# Altium schematic sheet Fluid_Valve_CTRL.SchDoc
size OrCAD B; SheetNumber: 6; SheetTotal: 11
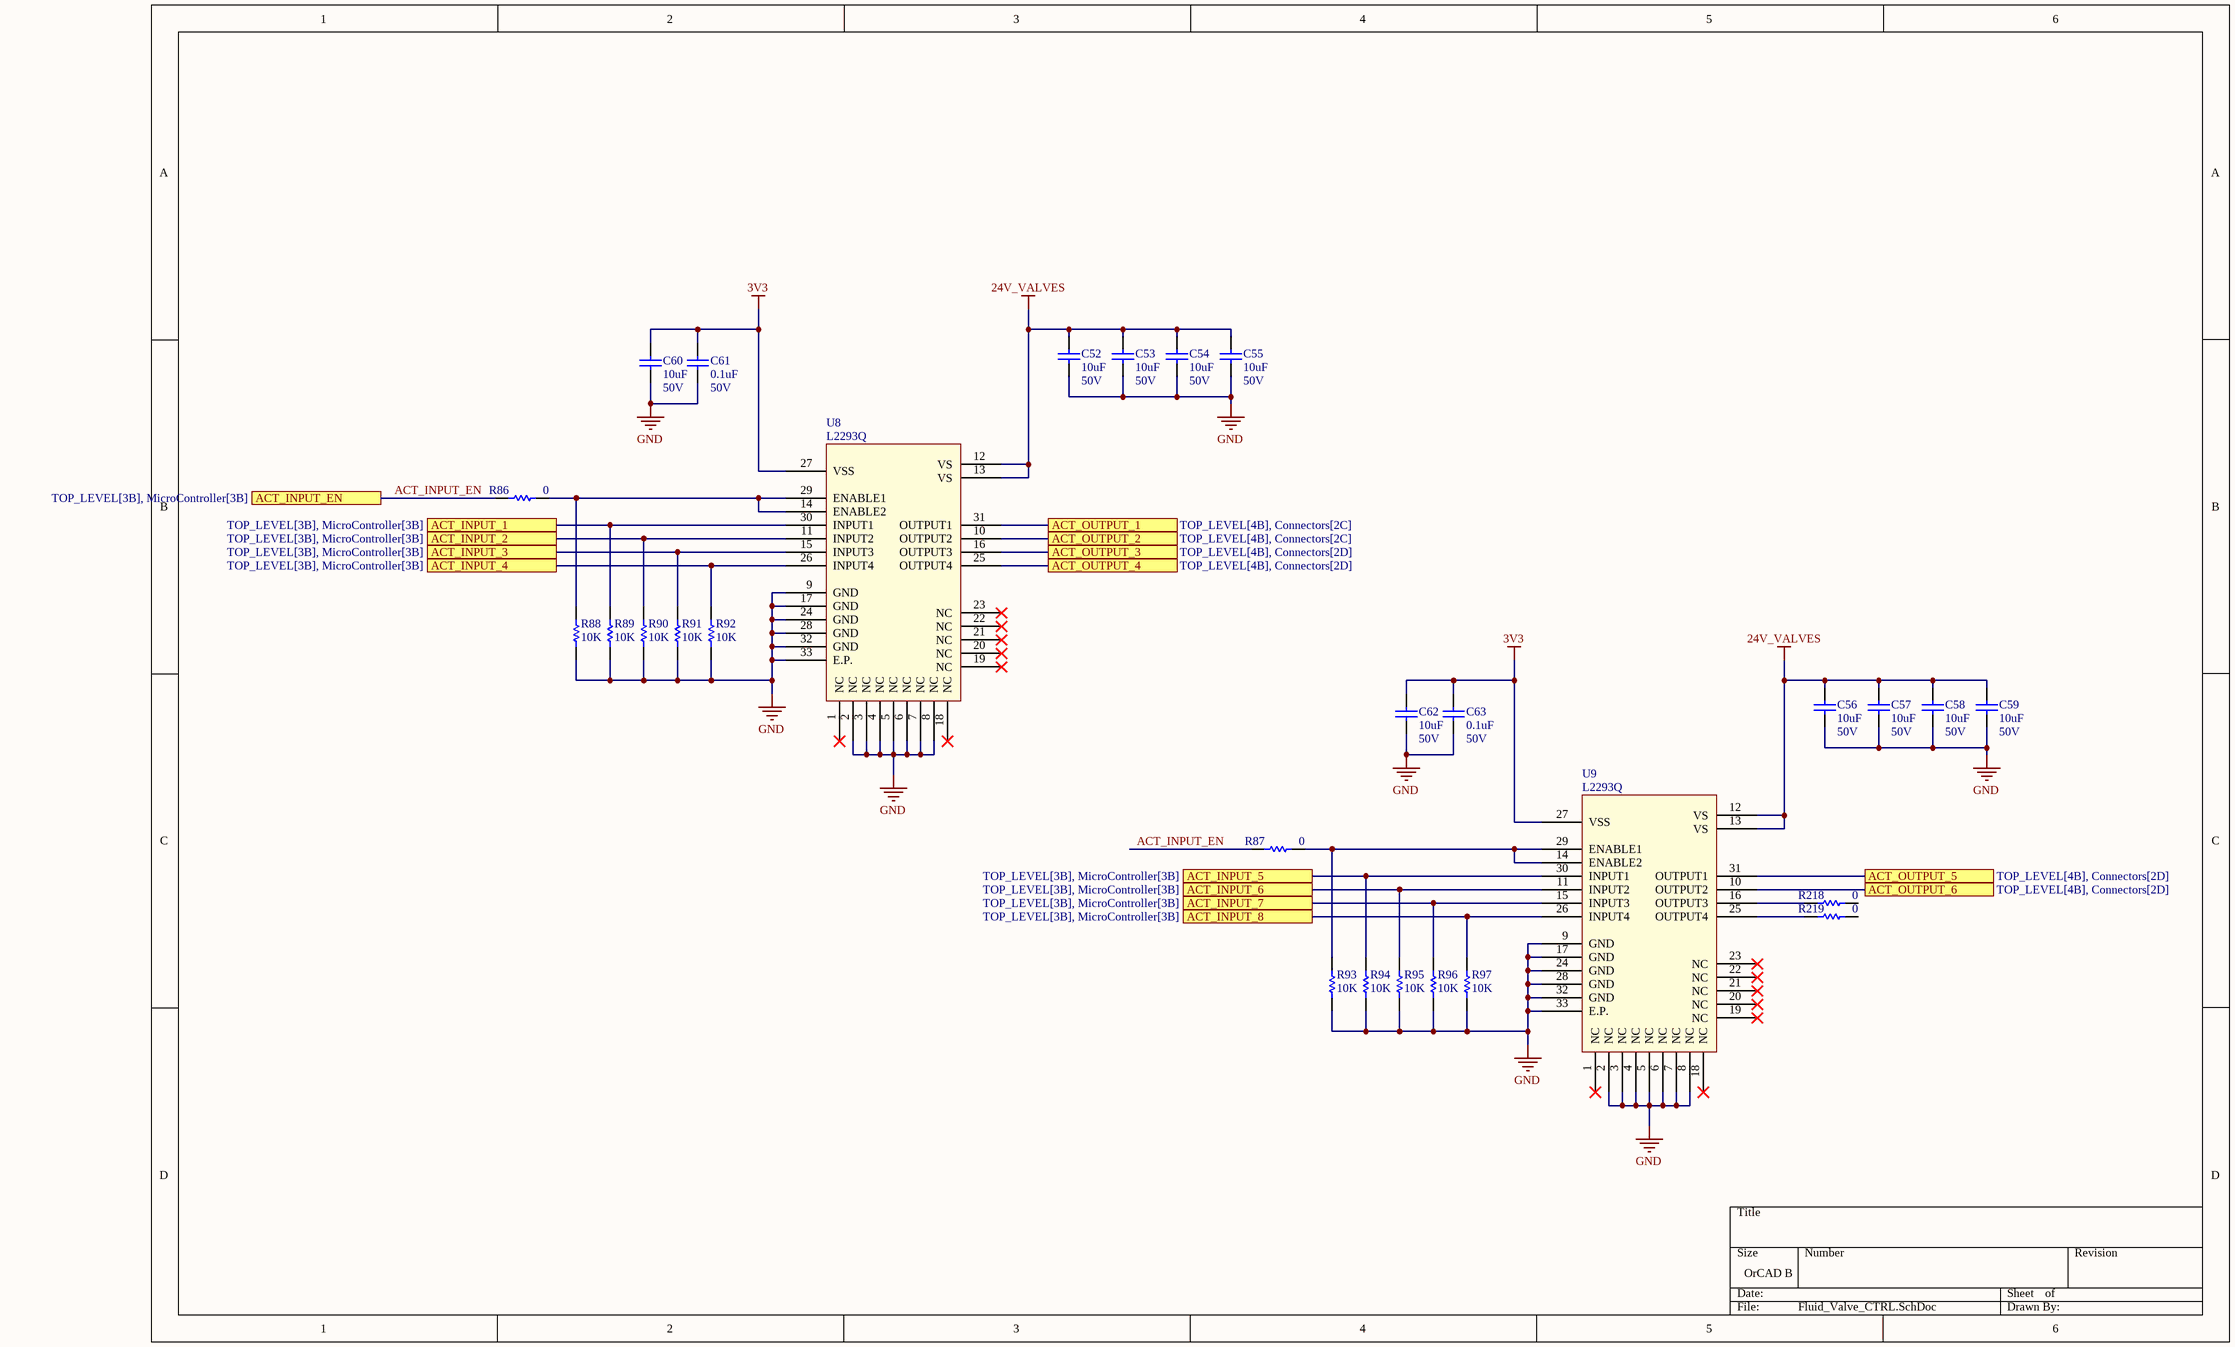
[diagram p0: Fluid_Valve_CTRL.SchDoc]

## Parts
C52  value 10uF  Rating: 50V  [DEFAULT_CAPACITOR_0805]  (hidden comment: GRM21BR61H106KE43L)
C53  value 10uF  Rating: 50V  [DEFAULT_CAPACITOR_0805]  (hidden comment: GRM21BR61H106KE43L)
C54  value 10uF  Rating: 50V  [DEFAULT_CAPACITOR_0805]  (hidden comment: GRM21BR61H106KE43L)
C55  value 10uF  Rating: 50V  [DEFAULT_CAPACITOR_0805]  (hidden comment: GRM21BR61H106KE43L)
C56  value 10uF  Rating: 50V  [DEFAULT_CAPACITOR_0805]  (hidden comment: GRM21BR61H106KE43L)
C57  value 10uF  Rating: 50V  [DEFAULT_CAPACITOR_0805]  (hidden comment: GRM21BR61H106KE43L)
C58  value 10uF  Rating: 50V  [DEFAULT_CAPACITOR_0805]  (hidden comment: GRM21BR61H106KE43L)
C59  value 10uF  Rating: 50V  [DEFAULT_CAPACITOR_0805]  (hidden comment: GRM21BR61H106KE43L)
C60  value 10uF  Rating: 50V  [DEFAULT_CAPACITOR_0805]  (hidden comment: GRM21BR61H106KE43L)
C61  value 0.1uF  Rating: 50V  [DEFAULT_CAPACITOR_0805]  (hidden comment: KGM21NR71H104KT)
C62  value 10uF  Rating: 50V  [DEFAULT_CAPACITOR_0805]  (hidden comment: GRM21BR61H106KE43L)
C63  value 0.1uF  Rating: 50V  [DEFAULT_CAPACITOR_0805]  (hidden comment: KGM21NR71H104KT)
R86  value 0  [DEFAULT_RESISTOR_0805]  (hidden comment: RC0805JR-070RL)
R87  value 0  [DEFAULT_RESISTOR_0805]  (hidden comment: RC0805JR-070RL)
R88  value 10K  [DEFAULT_RESISTOR_0805]  (hidden comment: CRCW080510K0FKEA)
R89  value 10K  [DEFAULT_RESISTOR_0805]  (hidden comment: CRCW080510K0FKEA)
R90  value 10K  [DEFAULT_RESISTOR_0805]  (hidden comment: CRCW080510K0FKEA)
R91  value 10K  [DEFAULT_RESISTOR_0805]  (hidden comment: CRCW080510K0FKEA)
R92  value 10K  [DEFAULT_RESISTOR_0805]  (hidden comment: CRCW080510K0FKEA)
R93  value 10K  [DEFAULT_RESISTOR_0805]  (hidden comment: CRCW080510K0FKEA)
R94  value 10K  [DEFAULT_RESISTOR_0805]  (hidden comment: CRCW080510K0FKEA)
R95  value 10K  [DEFAULT_RESISTOR_0805]  (hidden comment: CRCW080510K0FKEA)
R96  value 10K  [DEFAULT_RESISTOR_0805]  (hidden comment: CRCW080510K0FKEA)
R97  value 10K  [DEFAULT_RESISTOR_0805]  (hidden comment: CRCW080510K0FKEA)
R218  value 0  [DEFAULT_RESISTOR_0805]  (hidden comment: RC0805JR-070RL)
R219  value 0  [DEFAULT_RESISTOR_0805]  (hidden comment: RC0805JR-070RL)
U8  L2293Q  [L2293Q]
U9  L2293Q  [L2293Q]

## Ports
ACT_INPUT_1 (see TOP_LEVEL[3B], MicroController[3B]), ACT_INPUT_2 (see TOP_LEVEL[3B], MicroController[3B]), ACT_INPUT_3 (see TOP_LEVEL[3B], MicroController[3B]), ACT_INPUT_4 (see TOP_LEVEL[3B], MicroController[3B]), ACT_INPUT_5 (see TOP_LEVEL[3B], MicroController[3B]), ACT_INPUT_6 (see TOP_LEVEL[3B], MicroController[3B]), ACT_INPUT_7 (see TOP_LEVEL[3B], MicroController[3B]), ACT_INPUT_8 (see TOP_LEVEL[3B], MicroController[3B]), ACT_INPUT_EN (see TOP_LEVEL[3B], MicroController[3B]), ACT_OUTPUT_1 (see TOP_LEVEL[4B], Connectors[2C]), ACT_OUTPUT_2 (see TOP_LEVEL[4B], Connectors[2C]), ACT_OUTPUT_3 (see TOP_LEVEL[4B], Connectors[2D]), ACT_OUTPUT_4 (see TOP_LEVEL[4B], Connectors[2D]), ACT_OUTPUT_5 (see TOP_LEVEL[4B], Connectors[2D]), ACT_OUTPUT_6 (see TOP_LEVEL[4B], Connectors[2D])

## Nets
3V3: C60.2 C61.2 C62.2 C63.2 U8.27(VSS) U9.27(VSS)
24V_VALVES: C52.2 C53.2 C54.2 C55.2 C56.2 C57.2 C58.2 C59.2 U8.12(VS) U8.13(VS) U9.12(VS) U9.13(VS)
GND: C52.1 C53.1 C54.1 C55.1 C56.1 C57.1 C58.1 C59.1 C60.1 C61.1 C62.1 C63.1 R88.2 R89.2 R90.2 R91.2 R92.2 R93.2 R94.2 R95.2 R96.2 R97.2 U8.2(NC) U8.3(NC) U8.4(NC) U8.5(NC) U8.6(NC) U8.7(NC) U8.8(NC) U8.9(GND) U8.17(GND) U8.24(GND) U8.28(GND) U8.32(GND) U8.33(E.P.) U9.2(NC) U9.3(NC) U9.4(NC) U9.5(NC) U9.6(NC) U9.7(NC) U9.8(NC) U9.9(GND) U9.17(GND) U9.24(GND) U9.28(GND) U9.32(GND) U9.33(E.P.)
ACT_INPUT_1: R89.1 U8.30(INPUT1) ; port ACT_INPUT_1
ACT_INPUT_2: R90.1 U8.11(INPUT2) ; port ACT_INPUT_2
ACT_INPUT_3: R91.1 U8.15(INPUT3) ; port ACT_INPUT_3
ACT_INPUT_4: R92.1 U8.26(INPUT4) ; port ACT_INPUT_4
ACT_INPUT_5: R94.1 U9.30(INPUT1) ; port ACT_INPUT_5
ACT_INPUT_6: R95.1 U9.11(INPUT2) ; port ACT_INPUT_6
ACT_INPUT_7: R96.1 U9.15(INPUT3) ; port ACT_INPUT_7
ACT_INPUT_8: R97.1 U9.26(INPUT4) ; port ACT_INPUT_8
ACT_INPUT_EN: R86.2 R87.2 ; port ACT_INPUT_EN
ACT_OUTPUT_1: U8.31(OUTPUT1) ; port ACT_OUTPUT_1
ACT_OUTPUT_2: U8.10(OUTPUT2) ; port ACT_OUTPUT_2
ACT_OUTPUT_3: U8.16(OUTPUT3) ; port ACT_OUTPUT_3
ACT_OUTPUT_4: U8.25(OUTPUT4) ; port ACT_OUTPUT_4
ACT_OUTPUT_5: U9.31(OUTPUT1) ; port ACT_OUTPUT_5
ACT_OUTPUT_6: U9.10(OUTPUT2) ; port ACT_OUTPUT_6
NetR86_1: R86.1 R88.1 U8.14(ENABLE2) U8.29(ENABLE1)
NetR87_1: R87.1 R93.1 U9.14(ENABLE2) U9.29(ENABLE1)
NetR218_2: R218.2 U9.16(OUTPUT3)
NetR219_2: R219.2 U9.25(OUTPUT4)

Not connected (* = marked no-connect by the designer): R218 1; R219 1; U8 1(NC)* 18(NC)* 19(NC)* 20(NC)* 21(NC)* 22(NC)* 23(NC)*; U9 1(NC)* 18(NC)* 19(NC)* 20(NC)* 21(NC)* 22(NC)* 23(NC)*

## Library data of the parts
C52-C60 C62 = GRM21BR61H106KE43L: CAP CER 10UF 50V X5R 0805; MFR PN: GRM21BR61H106KE43L
C61 C63 = KGM21NR71H104KT: CAP CER 0.1UF 50V X7R 0805; Manufacturer: Cal-Chip Electronics, Inc.; Manufacturer P/N: GMC55X7R226M50NT; MFR PN: KGM21NR71H104KT
R86 R87 R218 R219 = RC0805JR-070RL: RES 0 OHM JUMPER 1/8W 0805; Power: 1/8W; MFR PN: RC0805JR-070RL; Tolerance: *
R88-R97 = CRCW080510K0FKEA: RES SMD 10K OHM 1% 1/4W 0805; Power: 1/4W; MFR PN: CRCW080510K0FKEA; Tolerance: 1%
U8 U9 = L2293Q: IC HALF BRIDG DRV 600MA 32VFQFPN; Manufacturer: STMicroelectronics; MFR PN: L2293Q; Manufacturer P/N: L2293Q